# Altium schematic sheet DRIVE.SchDoc
size A3
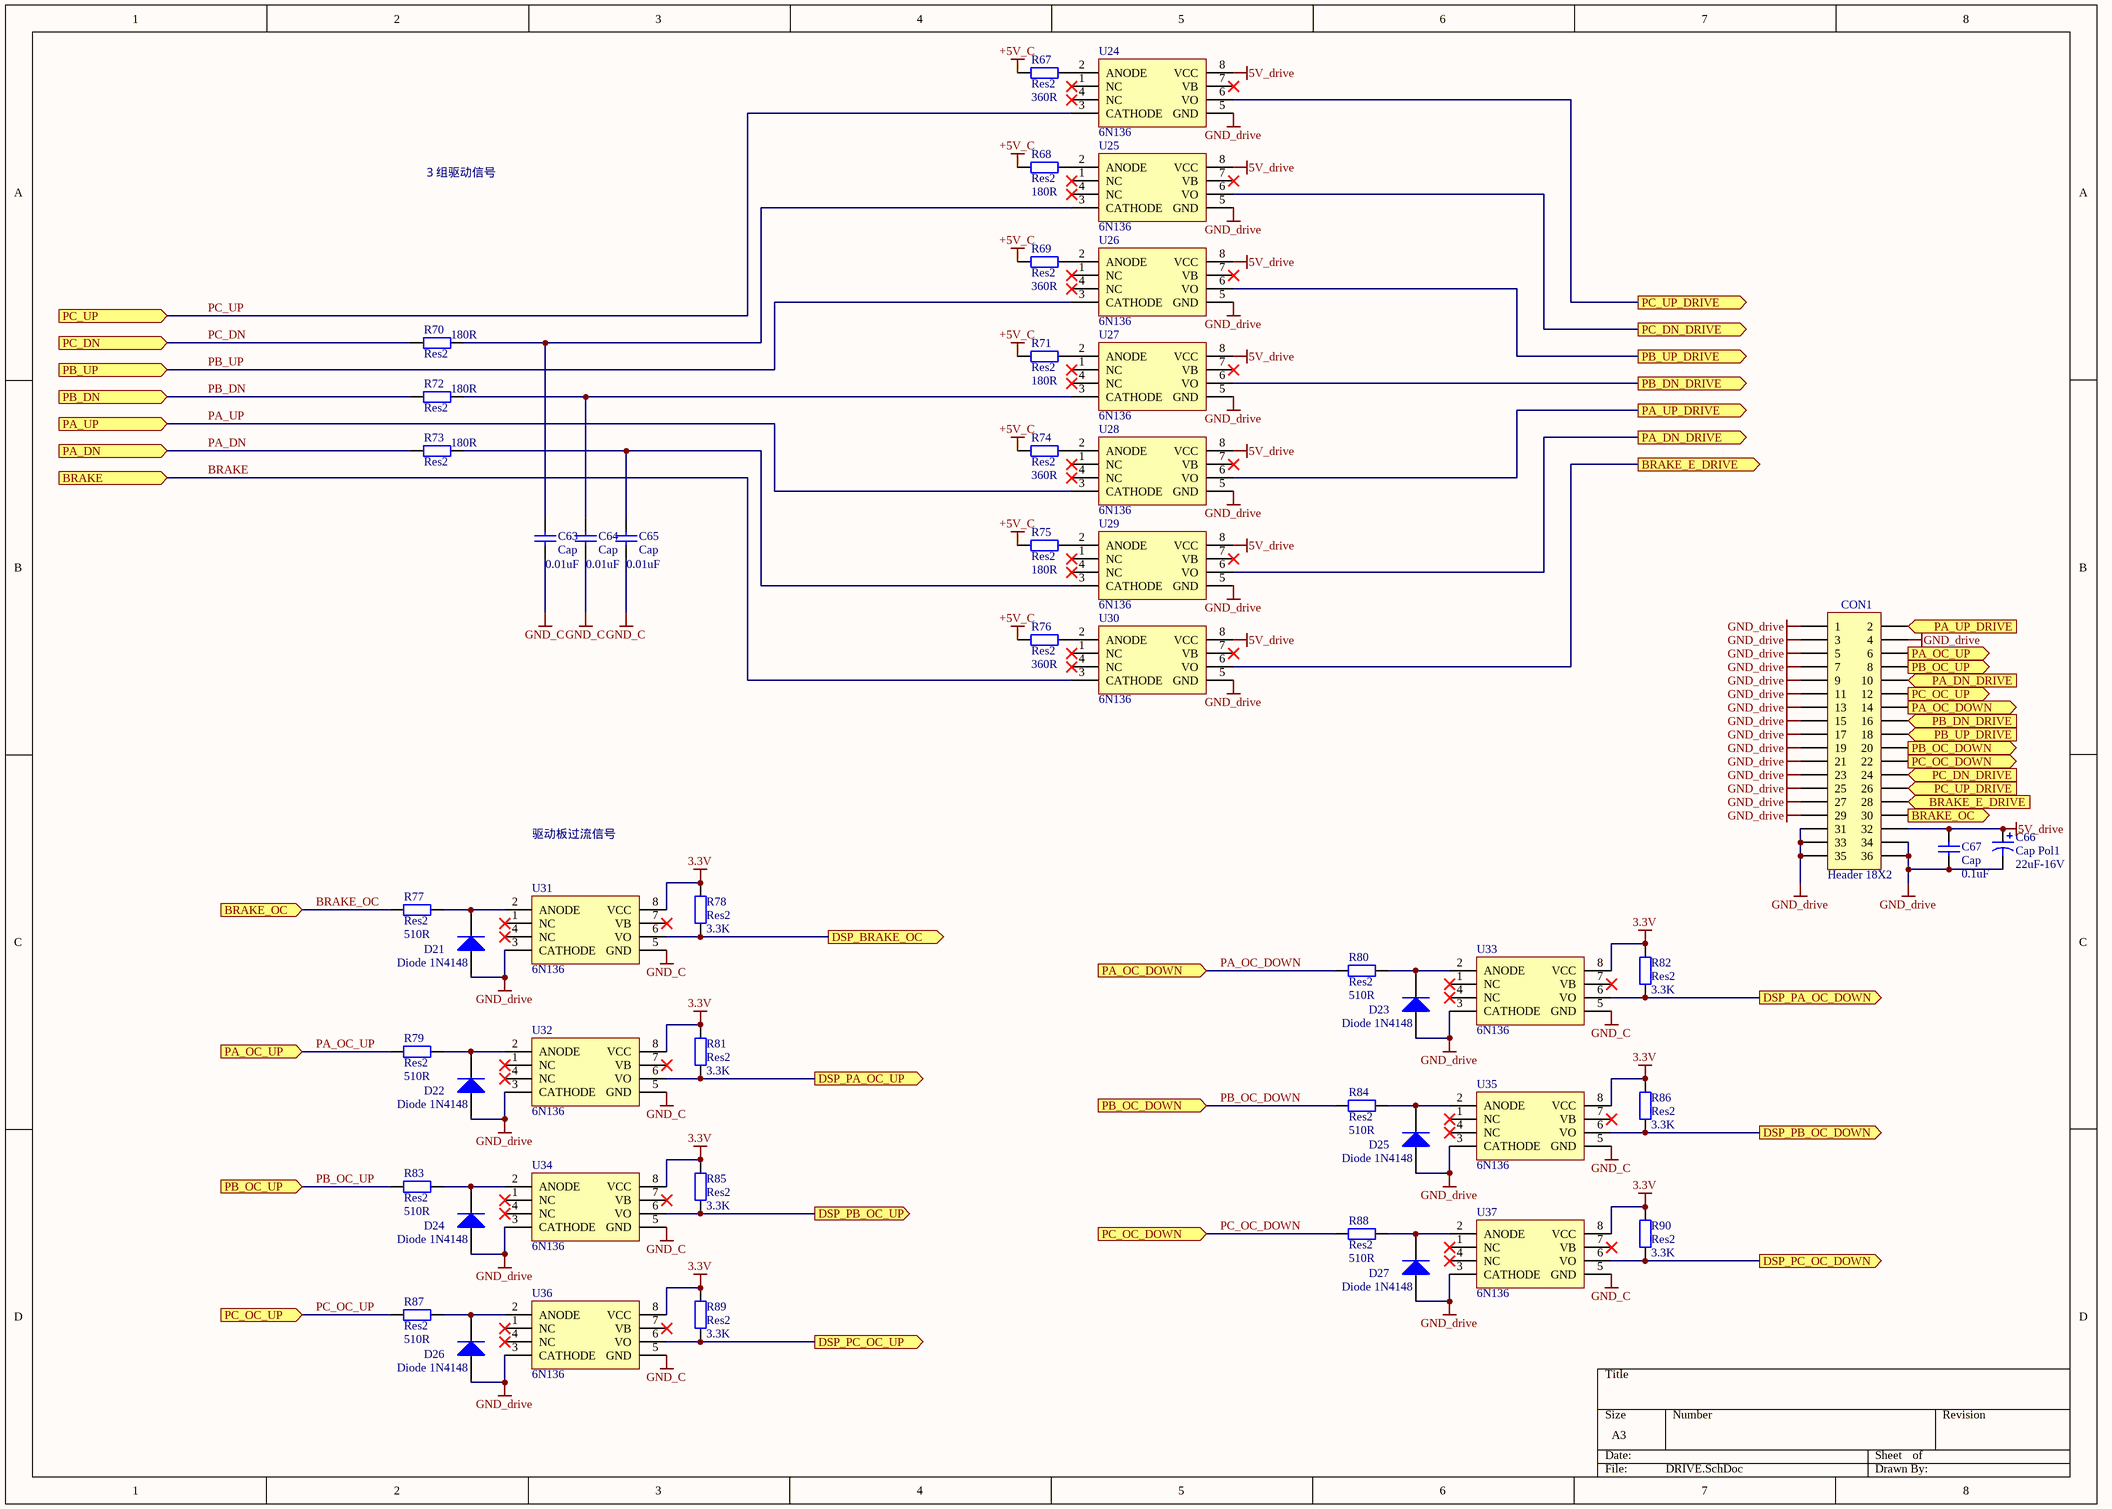
[diagram p0: DRIVE.SchDoc]

## Parts
C63  Cap  value 0.01uF  [1206]
C64  Cap  value 0.01uF  [1206]
C65  Cap  value 0.01uF  [1206]
C66  Cap Pol1  value 22uF-16V  [7343]
C67  Cap  value 0.1uF  [1206]
CON1  Header 18X2  [HDR2X18]
D21  Diode 1N4148  [SOD-80/MLL34]
D22  Diode 1N4148  [SOD-80/MLL34]
D23  Diode 1N4148  [SOD-80/MLL34]
D24  Diode 1N4148  [SOD-80/MLL34]
D25  Diode 1N4148  [SOD-80/MLL34]
D26  Diode 1N4148  [SOD-80/MLL34]
D27  Diode 1N4148  [SOD-80/MLL34]
R67  Res2  value 360R  [1206]
R68  Res2  value 180R  [1206]
R69  Res2  value 360R  [1206]
R70  Res2  value 180R  [1206]
R71  Res2  value 180R  [1206]
R72  Res2  value 180R  [1206]
R73  Res2  value 180R  [1206]
R74  Res2  value 360R  [1206]
R75  Res2  value 180R  [1206]
R76  Res2  value 360R  [1206]
R77  Res2  value 510R  [1206]
R78  Res2  value 3.3K  [1206]
R79  Res2  value 510R  [1206]
R80  Res2  value 510R  [1206]
R81  Res2  value 3.3K  [1206]
R82  Res2  value 3.3K  [1206]
R83  Res2  value 510R  [1206]
R84  Res2  value 510R  [1206]
R85  Res2  value 3.3K  [1206]
R86  Res2  value 3.3K  [1206]
R87  Res2  value 510R  [1206]
R88  Res2  value 510R  [1206]
R89  Res2  value 3.3K  [1206]
R90  Res2  value 3.3K  [1206]
U24  6N136  [DIP-8N]
U25  6N136  [DIP-8N]
U26  6N136  [DIP-8N]
U27  6N136  [DIP-8N]
U28  6N136  [DIP-8N]
U29  6N136  [DIP-8N]
U30  6N136  [DIP-8N]
U31  6N136  [DIP-8N]
U32  6N136  [DIP-8N]
U33  6N136  [DIP-8N]
U34  6N136  [DIP-8N]
U35  6N136  [DIP-8N]
U36  6N136  [DIP-8N]
U37  6N136  [DIP-8N]

## Ports
BRAKE (in), BRAKE_E_DRIVE (in), BRAKE_E_DRIVE (out), BRAKE_OC (in), BRAKE_OC (out), DSP_BRAKE_OC (out), DSP_PA_OC_DOWN (out), DSP_PA_OC_UP (out), DSP_PB_OC_DOWN (out), DSP_PB_OC_UP (out), DSP_PC_OC_DOWN (out), DSP_PC_OC_UP (out), PA_DN (in), PA_DN_DRIVE (in), PA_DN_DRIVE (out), PA_OC_DOWN (in), PA_OC_DOWN (out), PA_OC_UP (in), PA_OC_UP (out), PA_UP (in), PA_UP_DRIVE (in), PA_UP_DRIVE (out), PB_DN (in), PB_DN_DRIVE (in), PB_DN_DRIVE (out), PB_OC_DOWN (in), PB_OC_DOWN (out), PB_OC_UP (in), PB_OC_UP (out), PB_UP (in), PB_UP_DRIVE (in), PB_UP_DRIVE (out), PC_DN (in), PC_DN_DRIVE (in), PC_DN_DRIVE (out), PC_OC_DOWN (in), PC_OC_DOWN (out), PC_OC_UP (in), PC_OC_UP (out), PC_UP (in), PC_UP_DRIVE (in), PC_UP_DRIVE (out)

## Nets
3.3V: R78.2 R81.2 R82.2 R85.2 R86.2 R89.2 R90.2 U31.8(VCC) U32.8(VCC) U33.8(VCC) U34.8(VCC) U35.8(VCC) U36.8(VCC) U37.8(VCC)
5V_drive: C66.1 C67.2 CON1.32 U24.8(VCC) U25.8(VCC) U26.8(VCC) U27.8(VCC) U28.8(VCC) U29.8(VCC) U30.8(VCC)
+5V_C: R67.1 R68.1 R69.1 R71.1 R74.1 R75.1 R76.1
GND_C: C63.1 C64.1 C65.1 U31.5(GND) U32.5(GND) U33.5(GND) U34.5(GND) U35.5(GND) U36.5(GND) U37.5(GND)
GND_drive: C66.2 C67.1 CON1.1 CON1.3 CON1.4 CON1.5 CON1.7 CON1.9 CON1.11 CON1.13 CON1.15 CON1.17 CON1.19 CON1.21 CON1.23 CON1.25 CON1.27 CON1.29 CON1.31 CON1.33 CON1.34 CON1.35 CON1.36 D21.1(A) D22.1(A) D23.1(A) D24.1(A) D25.1(A) D26.1(A) D27.1(A) U24.5(GND) U25.5(GND) U26.5(GND) U27.5(GND) U28.5(GND) U29.5(GND) U30.5(GND) U31.3(CATHODE) U32.3(CATHODE) U33.3(CATHODE) U34.3(CATHODE) U35.3(CATHODE) U36.3(CATHODE) U37.3(CATHODE)
BRAKE: U30.3(CATHODE) ; port BRAKE
BRAKE_E_DRIVE: CON1.28 U30.6(VO) ; port BRAKE_E_DRIVE
BRAKE_OC: CON1.30 R77.2 ; port BRAKE_OC
DSP_BRAKE_OC: R78.1 U31.6(VO) ; port DSP_BRAKE_OC
DSP_PA_OC_DOWN: R82.1 U33.6(VO) ; port DSP_PA_OC_DOWN
DSP_PA_OC_UP: R81.1 U32.6(VO) ; port DSP_PA_OC_UP
DSP_PB_OC_DOWN: R86.1 U35.6(VO) ; port DSP_PB_OC_DOWN
DSP_PB_OC_UP: R85.1 U34.6(VO) ; port DSP_PB_OC_UP
DSP_PC_OC_DOWN: R90.1 U37.6(VO) ; port DSP_PC_OC_DOWN
DSP_PC_OC_UP: R89.1 U36.6(VO) ; port DSP_PC_OC_UP
PA_DN: R73.1 ; port PA_DN
PA_DN_DRIVE: CON1.10 U29.6(VO) ; port PA_DN_DRIVE
PA_OC_DOWN: CON1.14 R80.2 ; port PA_OC_DOWN
PA_OC_UP: CON1.6 R79.2 ; port PA_OC_UP
PA_UP: U28.3(CATHODE) ; port PA_UP
PA_UP_DRIVE: CON1.2 U28.6(VO) ; port PA_UP_DRIVE
PB_DN: R72.1 ; port PB_DN
PB_DN_DRIVE: CON1.16 U27.6(VO) ; port PB_DN_DRIVE
PB_OC_DOWN: CON1.20 R84.2 ; port PB_OC_DOWN
PB_OC_UP: CON1.8 R83.2 ; port PB_OC_UP
PB_UP: U26.3(CATHODE) ; port PB_UP
PB_UP_DRIVE: CON1.18 U26.6(VO) ; port PB_UP_DRIVE
PC_DN: R70.1 ; port PC_DN
PC_DN_DRIVE: CON1.24 U25.6(VO) ; port PC_DN_DRIVE
PC_OC_DOWN: CON1.22 R88.2 ; port PC_OC_DOWN
PC_OC_UP: CON1.12 R87.2 ; port PC_OC_UP
PC_UP: U24.3(CATHODE) ; port PC_UP
PC_UP_DRIVE: CON1.26 U24.6(VO) ; port PC_UP_DRIVE
NetC63_2: C63.2 R70.2 U25.3(CATHODE)
NetC64_2: C64.2 R72.2 U27.3(CATHODE)
NetC65_2: C65.2 R73.2 U29.3(CATHODE)
NetD21_2: D21.2(K) R77.1 U31.2(ANODE)
NetD22_2: D22.2(K) R79.1 U32.2(ANODE)
NetD23_2: D23.2(K) R80.1 U33.2(ANODE)
NetD24_2: D24.2(K) R83.1 U34.2(ANODE)
NetD25_2: D25.2(K) R84.1 U35.2(ANODE)
NetD26_2: D26.2(K) R87.1 U36.2(ANODE)
NetD27_2: D27.2(K) R88.1 U37.2(ANODE)
NetR67_2: R67.2 U24.2(ANODE)
NetR68_2: R68.2 U25.2(ANODE)
NetR69_2: R69.2 U26.2(ANODE)
NetR71_2: R71.2 U27.2(ANODE)
NetR74_2: R74.2 U28.2(ANODE)
NetR75_2: R75.2 U29.2(ANODE)
NetR76_2: R76.2 U30.2(ANODE)

Not connected (* = marked no-connect by the designer): U24 1(NC)* 4(NC)* 7(VB)*; U25 1(NC)* 4(NC)* 7(VB)*; U26 1(NC)* 4(NC)* 7(VB)*; U27 1(NC)* 4(NC)* 7(VB)*; U28 1(NC)* 4(NC)* 7(VB)*; U29 1(NC)* 4(NC)* 7(VB)*; U30 1(NC)* 4(NC)* 7(VB)*; U31 1(NC)* 4(NC)* 7(VB)*; U32 1(NC)* 4(NC)* 7(VB)*; U33 1(NC)* 4(NC)* 7(VB)*; U34 1(NC)* 4(NC)* 7(VB)*; U35 1(NC)* 4(NC)* 7(VB)*; U36 1(NC)* 4(NC)* 7(VB)*; U37 1(NC)* 4(NC)* 7(VB)*

## Notes on the sheet
- ３组驱动信号
- 驱动板过流信号

## Library data of the parts
C63-C65 C67 = Cap: Capacitor; Published: 8-Jun-2000; LatestRevisionDate: 17-Jul-2002; LatestRevisionNote: Re-released for DXP Platform.; PackageReference: RAD-0.3; Publisher: Altium Limited
C66 = Cap Pol1: Polarized Capacitor (Radial); Published: 8-Jun-2000; LatestRevisionDate: 17-Jul-2002; LatestRevisionNote: Re-released for DXP Platform.; PackageReference: RB7.6-15; Publisher: Altium Limited
CON1 = Header 18X2: Header, 18-Pin, Dual row; LatestRevisionDate: 17-Jul-2002; LatestRevisionNote: Re-released for DXP Platform.; Publisher: Altium Limited
D21-D27 = Diode 1N4148: High Conductance Fast Diode; Published: 8-Jun-2000; LatestRevisionDate: 17-Jul-2002; LatestRevisionNote: Re-released for DXP Platform.; DatasheetVersion: 1997; PackageReference: DO-35; Publisher: Altium Limited; Code_JEDEC: DO-204-AH; ComponentLink1Description: Manufacturer Link; ComponentLink1URL: http://www.fairchildsemi.com/; ComponentLink2Description: Datasheet; ComponentLink2URL: http://www.fairchildsemi.com/ds/1N%2F1N4148.pdf
R67-R90 = Res2: Resistor; Published: 8-Jun-2000; LatestRevisionDate: 17-Jul-2002; LatestRevisionNote: Re-released for DXP Platform.; PackageReference: AXIAL-0.4; Publisher: Altium Limited
U24-U37 = 6N136: 光耦